# EasyEDA Pro project 鱼缸控制器(e-ink).epro, board PCB4
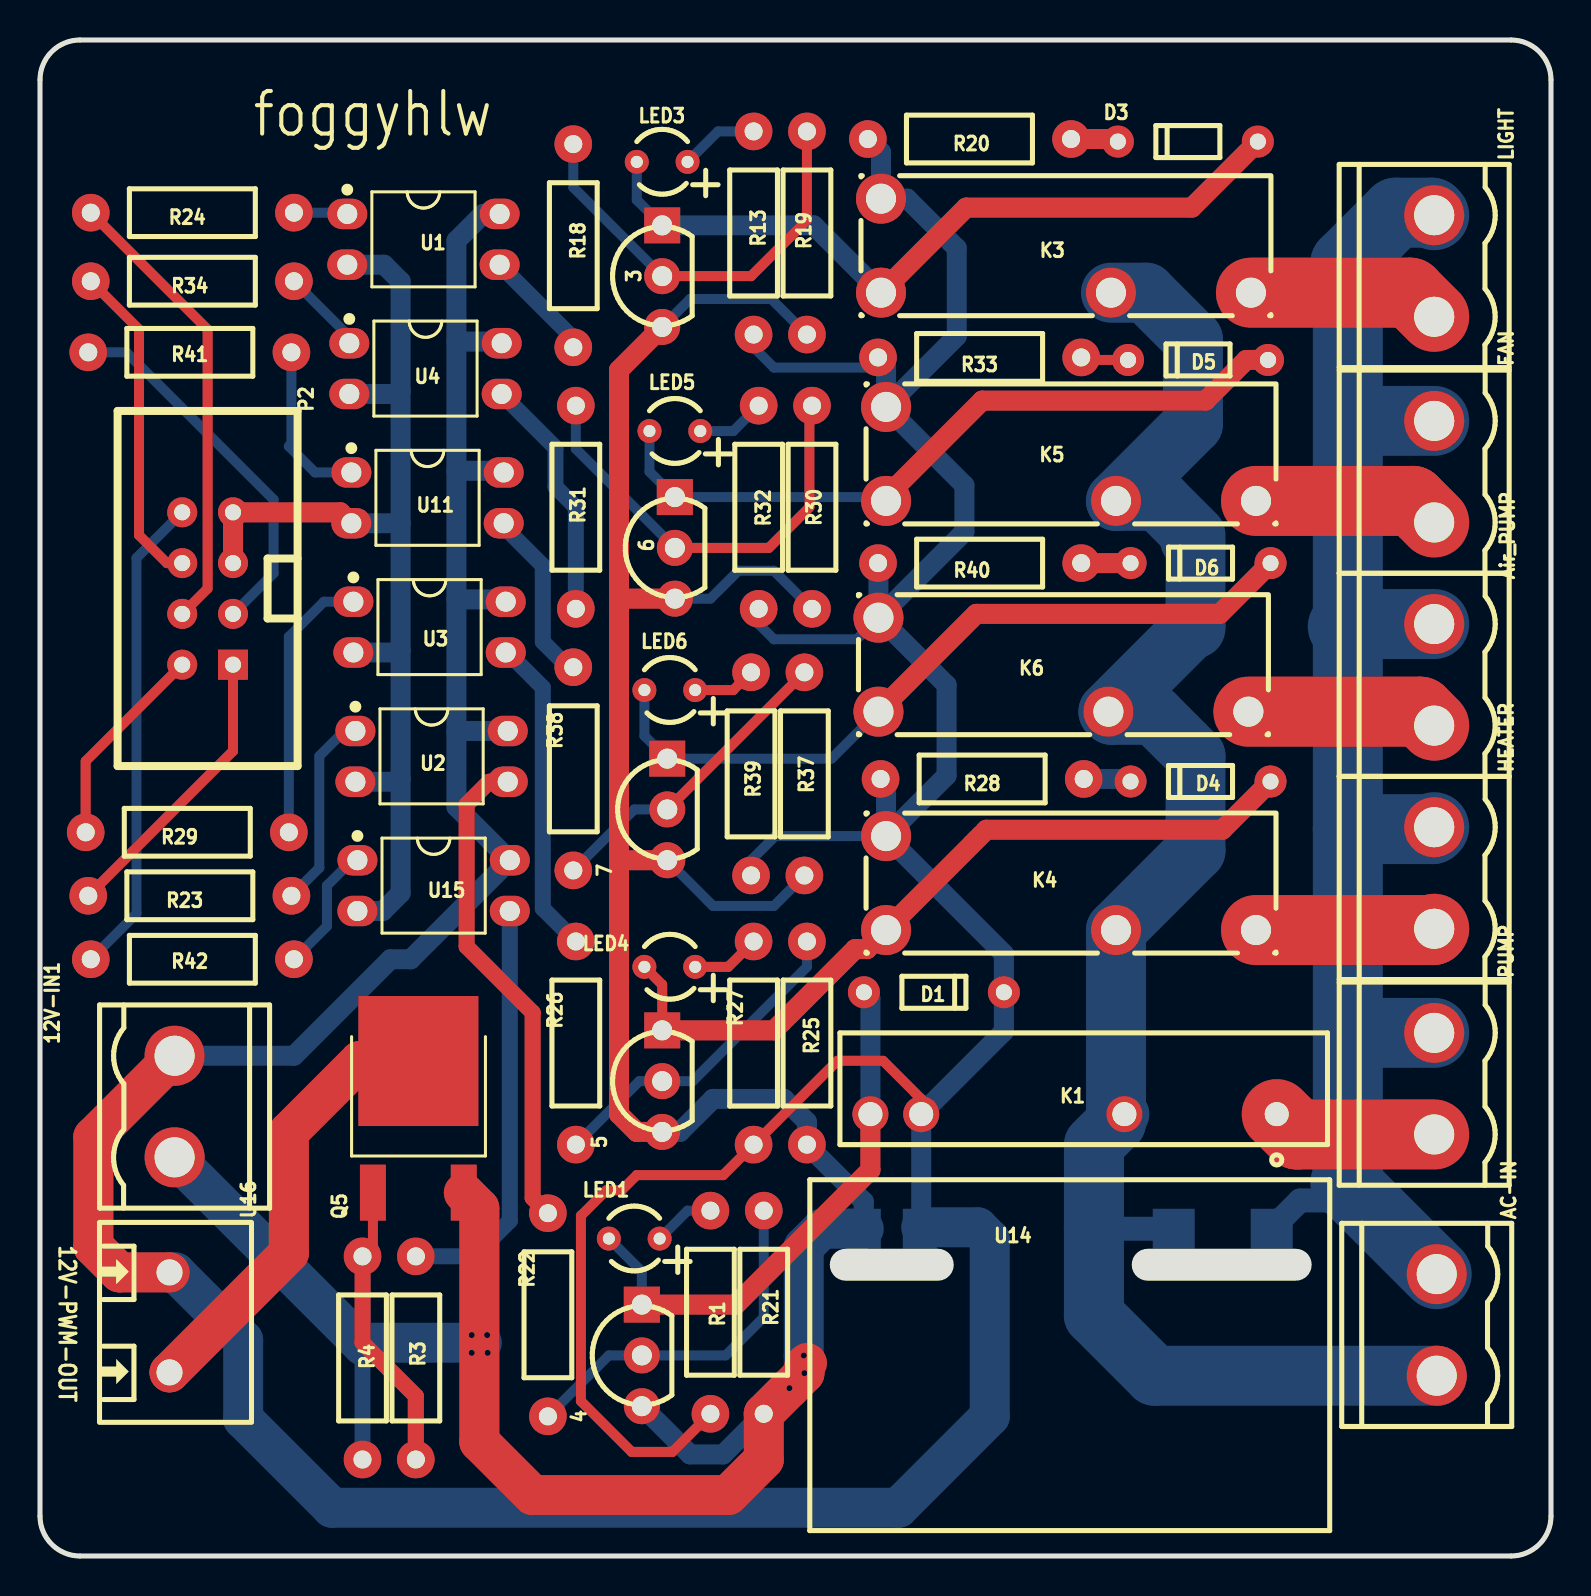
[diagram p6: board, top side]
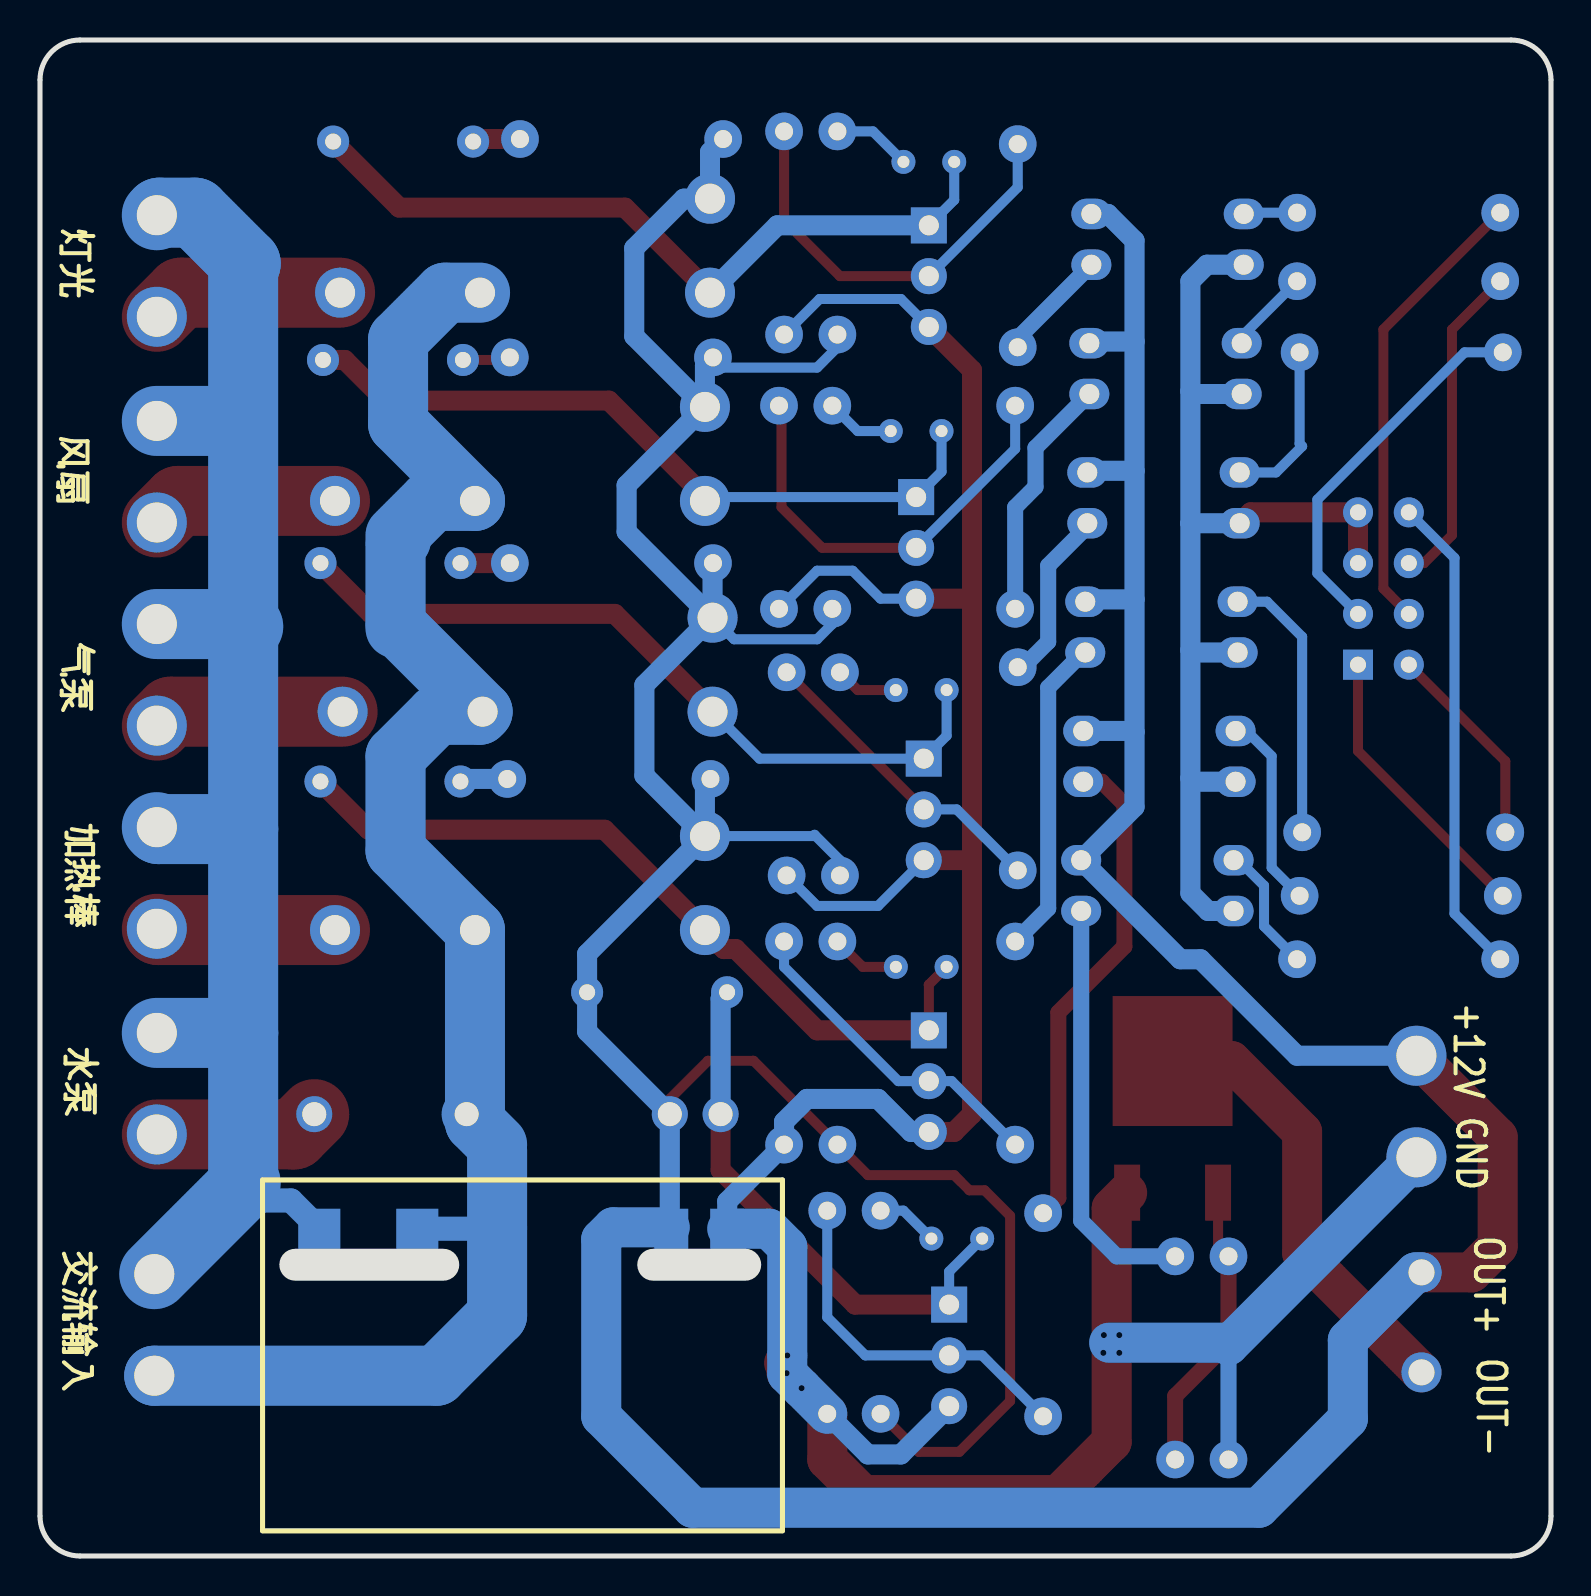
[diagram p7: board, bottom side, seen from below]

Outline 75.56 x 75.82 mm; copper layers: Top Layer, Bottom Layer. Coordinates in mm from the lower left corner of the outline.
Outline path: 0,73.82 0,2 arc(0.59,0.59) 2,0 73.56,0 arc(74.98,0.59) 75.56,2 75.56,73.82 arc(74.98,75.23) 73.56,75.82 2,75.82 arc(0.59,75.23) 0,73.82
Stack: Top Layer 0.035mm / Dielectric1 1.51mm FR4 er 4.5 / Bottom Layer 0.035mm

## Design rules (mm)
template: 自定义配置
spacing copperThickness1oz (default): track to track 0.102, other pairs 0.152 to 0.3
spacing copperThickness2oz: track to track 0.203, other pairs 0.152 to 0.3
track width copperThickness1oz (default): min 0.127, default 0.254, max 4
track width copperThickness2oz: min 0.203, default 0.254, max 2.54
differential pair differentialPair (default): width min 0.127, default 0.254, max 2.54; gap min 0.152, default 0.152
via viaSize (default): diameter min 0.5, default 0.61, max 10; hole min 0.3, default 0.305, max 6.3

## Placement (name value [footprint] x y rotation side)
3  8050M-D  [TO-92-3_L4.8-W3.7-P2.54-R]  31.12 64.01 90 top
4  8050M-D  [TO-92-3_L4.8-W3.7-P2.54-R]  30.1 10.03 90 top
5  8050M-D  [TO-92-3_L4.8-W3.7-P2.54-R]  31.12 23.75 90 top
6  8050M-D  [TO-92-3_L4.8-W3.7-P2.54-R]  31.75 50.42 90 top
7  8050M-D  [TO-92-3_L4.8-W3.7-P2.54-R]  31.37 37.34 90 top
12V-IN1  SIP2  [CONN-TH_2P-P5.08_DB2EV-5.08-2P-BK]  6.73 22.48 90 top
AC-IN  SIP2  [CONN-TH_2P-P5.08_DB2EV-5.08-2P-BK]  69.85 11.56 270 top
Air_PUMP  SIP2  [CONN-TH_2P-P5.08_DB2EV-5.08-2P-BK]  69.72 44.07 270 top
D1  1N4148S  [DO-34_BD1.6-L3.0-P7.00-D0.6-RD]  44.7 28.19 180 top
D3  1N4148S  [DO-34_BD1.6-L3.0-P7.00-D0.6-RD]  57.4 70.74 0 top
D4  1N4148S  [DO-34_BD1.6-L3.0-P7.00-D0.6-RD]  58.04 38.73 0 top
D5  1N4148S  [DO-34_BD1.6-L3.0-P7.00-D0.6-RD]  57.91 59.82 0 top
D6  1N4148S  [DO-34_BD1.6-L3.0-P7.00-D0.6-RD]  58.04 49.66 0 top
FAN  SIP2  [CONN-TH_2P-P5.08_DB2EV-5.08-2P-BK]  69.72 54.23 270 top
HEATER  SIP2  [CONN-TH_2P-P5.08_DB2EV-5.08-2P-BK]  69.72 33.91 270 top
K1  G3MB-202PL  [RELAY-TH_G3MB-202PL]  51.69 22.1 0 top
K3  HF46F/5-HS1T  [RELAY-TH_HF46F/5-HS1T]  51.31 65.53 0 top
K4  HF46F/5-HS1T  [RELAY-TH_HF46F/5-HS1T]  51.56 33.65 0 top
K5  HF46F/5-HS1T  [RELAY-TH_HF46F/5-HS1T]  51.56 55.12 0 top
K6  HF46F/5-HS1T  [RELAY-TH_HF46F/5-HS1T]  51.18 44.58 0 top
LED1  19-213/R6C-AN2Q1B/3T  [LED-TH_BD3.2-P2.54-FD]  29.72 15.87 180 top
LED3  19-213/R6C-AN2Q1B/3T  [LED-TH_BD3.2-P2.54-FD]  31.12 69.72 180 top
LED4  19-213/R6C-AN2Q1B/3T  [LED-TH_BD3.2-P2.54-FD]  31.5 29.46 180 top
LED5  19-213/R6C-AN2Q1B/3T  [LED-TH_BD3.2-P2.54-FD]  31.75 56.26 180 top
LED6  19-213/R6C-AN2Q1B/3T  [LED-TH_BD3.2-P2.54-FD]  31.5 43.31 180 top
LIGHT  SIP2  [CONN-TH_2P-P5.08_DB2EV-5.08-2P-BK]  69.72 64.52 270 top
P2  -  [DC3-8P]  8.38 48.39 270 top
PUMP  SIP2  [CONN-TH_2P-P5.08_DB2EV-5.08-2P-BK]  69.72 23.62 270 top
Q5  AOD4184A  [TO-252-2_L6.6-W6.1-P4.57-LS9.9-TL-CW]  18.92 21.46 90 top
R1  10k  [R_AXIAL-0.4]  33.53 12.19 270 top
R3  100R  [R_AXIAL-0.4]  18.8 9.91 270 top
R4  47kΩ  [R_AXIAL-0.4]  16.13 9.91 90 top
R13  10k  [R_AXIAL-0.4]  35.69 66.17 270 top
R18  1k  [R_AXIAL-0.4]  26.67 65.53 270 top
R19  10k  [R_AXIAL-0.4]  38.35 66.17 90 top
R20  100r  [R_AXIAL-0.4]  46.48 70.87 180 top
R21  10k  [R_AXIAL-0.4]  36.19 12.19 90 top
R22  1k  [R_AXIAL-0.4]  25.4 12.06 90 top
R23  1k  [R_AXIAL-0.4]  7.49 33.02 180 top
R24  1k  [R_AXIAL-0.4]  7.62 67.18 180 top
R25  10k  [R_AXIAL-0.4]  38.35 25.65 90 top
R26  1k  [R_AXIAL-0.4]  26.8 25.65 90 top
R27  10k  [R_AXIAL-0.4]  35.69 25.65 270 top
R28  100r  [R_AXIAL-0.4]  47.12 38.86 180 top
R29  1k  [R_AXIAL-0.4]  7.37 36.19 180 top
R30  10k  [R_AXIAL-0.4]  38.61 52.45 90 top
R31  1k  [R_AXIAL-0.4]  26.8 52.45 270 top
R32  10k  [R_AXIAL-0.4]  35.94 52.45 270 top
R33  100r  [R_AXIAL-0.4]  46.99 59.94 180 top
R34  1k  [R_AXIAL-0.4]  7.62 63.75 180 top
R37  10k  [R_AXIAL-0.4]  38.23 39.12 90 top
R38  1k  [R_AXIAL-0.4]  26.67 39.37 90 top
R39  10k  [R_AXIAL-0.4]  35.56 39.12 270 top
R40  100r  [R_AXIAL-0.4]  46.99 49.66 180 top
R41  1k  [R_AXIAL-0.4]  7.49 60.2 180 top
R42  1k  [R_AXIAL-0.4]  7.62 29.84 180 top
U1  PC817-4  [DIP-4_L4.6-W6.5-P2.54-LS7.6-BL]  19.18 65.85 270 top
U2  PC817-4  [DIP-4_L4.6-W6.5-P2.54-LS7.6-BL]  19.58 39.99 270 top
U3  PC817-4  [DIP-4_L4.6-W6.5-P2.54-LS7.6-BL]  19.48 46.46 270 top
U4  PC817-4  [DIP-4_L4.6-W6.5-P2.54-LS7.6-BL]  19.28 59.38 270 top
U11  PC817-4  [DIP-4_L4.6-W6.5-P2.54-LS7.6-BL]  19.38 52.92 270 top
U14  -  [瑞普达稳压模块]  39.5 15.37 0 top
U15  PC817-4  [DIP-4_L4.6-W6.5-P2.54-LS7.6-BL]  19.69 33.53 270 top
U16  WJ306V-5.0-2P-14-00A  [CONN-TH_2P-P5.00_L7.6-W10.0]  6.48 11.68 270 top

## Footprints (pads in the part's own frame, mm; a bottom-side part is the same pattern mirrored in y, then rotated)
CONN-TH_2P-P5.00_L7.6-W10.0
  round 2 hole 1.3: 1(-2.5,0) 2(2.5,0)
CONN-TH_2P-P5.08_DB2EV-5.08-2P-BK
  round 3 hole 2: 1(-2.54,0) 2(2.54,0)
DC3-8P
  rect 1.5x1.5 hole 0.8: 1(3.81,1.27)
  round 1.5 hole 0.8: 2(3.81,-1.27) 3(1.27,1.27) 4(1.27,-1.27) 5(-1.27,1.27) 6(-1.27,-1.27) 7(-3.81,1.27) 8(-3.81,-1.27)
DIP-4_L4.6-W6.5-P2.54-LS7.6-BL
  oval 1.524x2 hole 1: 1(-1.27,-3.81) 2(1.27,-3.81) 3(1.27,3.81) 4(-1.27,3.81)
DO-34_BD1.6-L3.0-P7.00-D0.6-RD
  round 1.6 hole 0.8: 1(-3.5,0) 2(3.5,0)
LED-TH_BD3.2-P2.54-FD
  round 1.2 hole 0.6: 1(-1.27,0) 2(1.27,0)
R_AXIAL-0.4
  round 1.879 hole 0.899: 1(-5.08,0) 2(5.08,0)
RELAY-TH_G3MB-202PL
  round 1.8 hole 1.2: 1(10.16,0) 2(2.54,0) 3(-7.62,0) 4(-10.16,0)
RELAY-TH_HF46F/5-HS1T
  round 2.5 hole 1.5: 1(-9.25,-2.35) 2(2.25,-2.35) 3(9.25,-2.35) 6(-9.25,2.35)
TO-92-3_L4.8-W3.7-P2.54-R
  rect 1.8x1.8 hole 1: 1(2.54,0)
  round 1.8 hole 1: 2(0,0) 3(-2.54,0)
TO-252-2_L6.6-W6.1-P4.57-LS9.9-TL-CW
  rect 2.8x1.3 smd: 1(-3.292,2.273) 3(-3.292,-2.273)
  rect 6.5x6 smd: 2(3.292,0)
瑞普达稳压模块
  rect 2.1x2 smd far side: 1(22.1,1) 2(17.2,1)
  rect 1.7x2 smd far side: 3(4.5,1) 4(1.7,1)

## Nets
As in the schematic.

## Via types
v1: diameter 0.61, hole 0.305, Top Layer to Bottom Layer, 7 vias

## Routing (per net, layer and track width the routed paths; a pad name or vN(x,y) marks a point on that pad's centre or on a via; arc(x,y) is an arc through that point)
+12V-P: length 283.2
  Top Layer w0.5: K1.3 44.07,22.86 42.16,24.76 39.88,24.76 R27.2 34.16,19.05 29.84,19.05 29.08,18.29 28.32,18.29 27.05,17.02 27.05,7.75 29.59,5.21 31.62,5.21 R1.2
  Top Layer w2: U16.1 3.98,14.18 2.67,15.49 2.67,20.95 12V-IN1.2
  Bottom Layer w0.5: R13.2 35.69,60.45 36.7,59.44 41.4,59.44 R33.2 ; R32.2 35.94,46.61 36.7,45.85 40.85,45.85 K6.6 ; K4.6 36.89,36 36.83,36.07 35.56,34.8 R39.2
  Bottom Layer w1: 20.83,54.27 20.83,60.74 ; 20.83,54.27 23.11,54.27 U11.4 ; 20.83,54.27 20.83,47.84 ; 20.83,60.74 23.01,60.74 U4.4 ; 20.83,60.74 20.83,65.79 22.16,67.12 U1.4 ; 20.83,47.84 23.18,47.84 U3.4 ; 20.83,47.84 20.83,41.21 ; 20.83,41.21 20.83,37.46 U15.4 18.54,29.84 17.53,29.84 12.7,25.02 12V-IN1.2 ; 20.83,41.21 20.88,41.26 U2.4 ; K6.6 41.93,49.64 R40.2 ; K6.6 41.97,46.93 45.34,43.56 45.34,39.03 K4.6 ; K6.6 46.23,51.22 46.23,53.55 K5.6 ; K4.6 48.2,30.11 D1.1 48.2,26.23 K1.3 44.07,16.44 U14.3 ; K4.6 42.31,38.59 42.04,38.86 ; K5.6 42.31,59.54 R33.2 ; K5.6 45.85,61 45.85,65.4 43.37,67.88 K3.6 42.06,70.21 R20.2
  Bottom Layer w2: U16.1 6.77,14.18 10.16,10.79 10.16,6.86 14.6,2.41 42.93,2.41 47.5,6.98 47.5,15.84 46.9,16.44 44.07,16.44
GND-P: length 168.3
  Top Layer w1: 28.96,47.86 28.96,34.72 ; 28.96,47.86 28.96,59.31 3.3 ; 28.96,47.86 28.97,47.88 6.3 ; 28.96,34.72 28.96,22.1 29.84,21.21 5.3 ; 28.96,34.72 29.03,34.8 7.3
  Top Layer w2: Q5.3 21.97,17.4 21.97,5.72 24.64,3.05 34.42,3.05 36.19,4.83 R21.1 v1(37.48,8.39) v1(38.23,9.14) 38.23,9.52 38.35,9.65
  Bottom Layer w0.5: R37.1 36.7,32.51 33.66,32.51 7.3 ; R30.1 36.7,49.28 34.92,49.28 33.53,47.88 6.3 ; R19.1 36.58,62.86 32.51,62.86 3.3
  Bottom Layer w0.8: 16.13,4.83 16.13,10.54
  Bottom Layer w1: R21.1 34.16,5.08 32.51,5.08 4.3 ; 41.2,16.37 41.2,17.73 R25.1 38.35,21.72 37.21,22.86 33.66,22.86 32,21.21 5.3
  Bottom Layer w2: 12V-IN1.1 16.13,10.54 16.26,10.67 22.1,10.67 ; R21.1 v1(37.48,8.39) 38.19,9.11 v1(38.19,10.03) 38.19,15.46 39.1,16.37 41.2,16.37
  vias: v1(21.59,11.05) v1(21.59,10.16) v1(22.36,11.05) v1(22.39,10.16)
GND-S: length 54.7
  Top Layer w1: U11.2 15.02,52.2 P2.7 P2.5
  Bottom Layer w1: 18.03,58.25 17.89,58.11 U4.2 ; 18.03,58.25 18.03,63.75 17.21,64.58 U1.2 ; 18.03,58.25 18.03,51.65 ; 18.03,38.9 18.03,33.15 17.14,32.26 U15.2 ; 18.03,38.9 17.86,38.72 U2.2 ; 18.03,38.9 18.03,45.3 ; 18.03,45.3 17.92,45.19 U3.2 ; 18.03,45.3 18.03,51.65 ; 18.03,51.65 18.03,51.65 U11.2
AC1: length 79.9
  Bottom Layer w1.2: 61.6,16.37 63.01,17.78 65.41,17.78
  Bottom Layer w3.5: LIGHT.1 69.6,67.18 67.82,67.18 65.28,64.64 65.41,64.52 65.41,46.61 ; 65.41,46.61 Air_PUMP.1 ; 65.41,46.61 65.41,36.35 ; 65.41,46.61 65.28,46.61 65.15,46.48 ; FAN.1 65.66,56.77 ; 65.41,36.35 69.63,36.35 HEATER.1 ; 65.41,36.35 65.41,26.16 ; 65.41,26.16 65.41,18.54 ; 65.41,26.16 PUMP.1 ; 65.41,18.54 AC-IN.1 ; 65.41,18.54 65.28,18.67
AC2: length 91.1
  Bottom Layer w1: 53.39,16.37 52.74,16.37 52.7,16.41
  Bottom Layer w1.2: 56.7,16.37 53.39,16.37
  Bottom Layer w2.5: 52.7,20.27 52.7,20.57 ; 57.51,50.82 55.56,52.77 ; 53.81,21.68 K1.2 ; 57.6,46.4 57.78,46.58
  Bottom Layer w3: 57.78,50.55 57.78,46.4 ; 57.78,50.73 57.69,50.82 57.51,50.82 ; 57.6,46.4 K6.2 53.59,42.07 55.72,42.07 57.78,40 57.78,35.28 K4.2 53.81,21.68 52.7,20.57 ; 57.78,51.05 56.07,52.77 53.81,52.77 57.66,56.61 57.66,60.83 55.31,63.18 K3.2 ; AC-IN.2 55.73,9.02 52.7,12.04 52.7,20.27
$1N1574: length 27.2
  Top Layer w1: 4.1 34.8,12.57 41.53,19.3 K1.4
  Bottom Layer w0.5: 4.1 30.1,14.22 LED1.2
  Bottom Layer w1: K1.4 41.53,27.87 D1.2
$1N1576: length 38
  Top Layer w1: K3.1 46.31,67.44 57.6,67.44 D3.2
  Bottom Layer w0.5: 31.12,66.55 29.84,67.82 LED3.2
  Bottom Layer w1: K3.1 38.69,66.55 31.12,66.55
$1N1577: length 5.7
  Bottom Layer w0.8: 26.67,60.45 26.67,60.9 U1.3
$1N1579: length 9.7
  Top Layer w3.5: LIGHT.2 68.52,63.18 K3.3
$1N1586: length 8.3
  Top Layer w3.5: 69.72,21.08 62.87,21.08 K1.1
$1N1589: length 3.1
  Bottom Layer w0.5: LED1.1 32.38,17.27 R1.1
$1N1590: length 21.3
  Top Layer w0.5: 3.2 35.56,64.01 38.35,66.8 R19.2
  Bottom Layer w0.5: R18.1 26.67,68.45 3.2
$1N1591: length 3.9
  Bottom Layer w0.5: R13.1 33.91,71.25 LED3.1
$1N1592: length 2.4
  Top Layer w1: D3.1 53.78,70.87 R20.1
$1N1594: length 24.7
  Top Layer w0.8: R22.2 24.64,17.91 24.64,27.18 21.34,30.48 21.34,37.59 22.47,38.72 U2.3
$1N1595: length 18.2
  Bottom Layer w0.5: R22.1 28.45,10.03 4.2 34.29,10.03 36.19,11.94 R21.2
$1N1598: length 9.9
  Bottom Layer w0.5: R23.1 13.97,34.42 13.97,40 15.23,41.26 U2.1
$1N1599: length 2.7
  Bottom Layer w0.5: R24.1 15.3,67.18 U1.1
$1N1602: length 39.1
  Top Layer w0.5: 5.1 31.12,28.57 LED4.2
  Top Layer w1: D4.2 59.13,36.32 47.33,36.32 K4.1 41.36,30.35 40.77,30.35 36.7,26.29 5.1
$1N1603: length 16
  Bottom Layer w0.8: U3.3 23.39,45.19 25.15,43.43 25.15,32.38 R26.2
$1N1605: length 8.9
  Top Layer w3.5: HEATER.2 69.66,31.3 K4.3
$1N1610: length 16.5
  Bottom Layer w0.5: R25.2 38.35,29.46 32.64,23.75 5.2 29.97,23.75 R26.1
$1N1611: length 3.4
  Top Layer w0.5: R27.1 34.42,29.46 LED4.1
$1N1612: length 2.4
  Bottom Layer w1: D4.1 54.41,38.86 R28.1
$1N1613: length 13.7
  Bottom Layer w0.5: U3.1 14.2,47.73 12.45,45.97 R29.1
$1N1616: length 36.6
  Top Layer w1: 42.31,52.77 42.31,52.98 47.12,57.78 58.29,57.78 60.32,59.82 D5.2
  Bottom Layer w0.5: 42.31,52.77 42.12,52.96 6.1 30.48,54.23 LED5.2
$1N1617: length 12.3
  Bottom Layer w0.8: R31.2 26.8,52.45 25.78,53.47 25.78,55.42 U4.3
$1N1619: length 9.4
  Top Layer w3.5: FAN.2 68.64,52.77 60.81,52.77
$1N1624: length 21.9
  Top Layer w0.5: 6.2 36.45,50.42 38.48,52.45 38.48,57.4 R30.2
  Bottom Layer w0.5: R31.1 26.8,55.37 6.2
$1N1625: length 3.4
  Bottom Layer w0.5: LED5.1 34.67,56.26 R32.1
$1N1626: length 2.4
  Top Layer w0.5: D5.1 52.2,59.82 R33.1
$1N1627: length 4.2
  Bottom Layer w0.5: U4.1 15.47,60.99 R34.1
$1N1630: length 38.1
  Top Layer w1: K6.1 46.82,47.12 59,47.12 D6.2
  Bottom Layer w0.5: LED6.2 30.23,41.02 7.1 39.58,39.88 K6.1
$1N1631: length 8.8
  Bottom Layer w0.8: R38.2 26.42,44.45 25.15,45.72 25.15,49.53 23.19,51.49 U11.3
$1N1633: length 9.6
  Top Layer w3.5: K6.3 69.03,42.23 Air_PUMP.2
$1N1638: length 15.7
  Top Layer w0.5: R37.2 7.2
  Bottom Layer w0.5: R38.1 29.72,37.34 7.2
$1N1639: length 3.2
  Top Layer w0.5: LED6.1 34.67,43.31 R39.1
$1N1640: length 2.5
  Top Layer w1: D6.1 R40.1
$1N1641: length 8.4
  Bottom Layer w0.5: R41.1 12.57,55.63 12.45,55.5 13.75,54.19 U11.1
$1N1644: length 16.4
  Top Layer w0.5: R34.2 4.95,61.34 4.95,51.05 6.35,49.66 P2.6
$1N1645: length 23
  Top Layer w0.5: R24.2 8.38,61.34 8.38,48.39 P2.4
$1N1646: length 10.4
  Top Layer w0.5: P2.2 2.29,39.75 R29.2
$1N1647: length 14.6
  Top Layer w0.5: R23.2 9.65,40.26 P2.1
$1N5127: length 18.9
  Bottom Layer w0.5: R41.2 4.32,60.2 11.68,52.83 11.68,49.15 P2.3
$1N5160: length 24.2
  Bottom Layer w0.5: R42.2 4.83,32.13 4.83,49.91 P2.8
$1N5227: length 6.4
  Bottom Layer w0.5: R42.1 14.35,31.5 14.35,33.53 15.62,34.8 U15.1
$1N5390: length 14.7
  Top Layer w0.5: 16.13,14.99 16.65,15.51 Q5.1
  Top Layer w0.8: 16.13,14.99 16.13,10.67 18.8,8 18.8,4.83
$1N5392: length 22.4
  Top Layer w2: U16.2 12.45,15.15 12.45,21.21 15.99,24.75 Q5.2
$1N5396: length 20.9
  Bottom Layer w0.8: 18.8,14.99 21.72,14.99 23.5,16.76 U15.3

## Copper pours and planes (outline as drawn; the poured copper is in the pictures)
GND-S on Bottom Layer: 1.14,70.48 19.18,70.48 19.18,28.57 1.14,28.57

## Text on the board
Bottom Silkscreen Layer: OUT- | OUT+ | GND | +12V | 加热棒 | 水泵 | 交流输入 | 气泵 | 灯光 | 风扇
Top Silkscreen Layer: 12V-PWM-OUT | foggyhlw
